# Altium schematic sheet Part11_I2S_WM8960.SchDoc
size A4
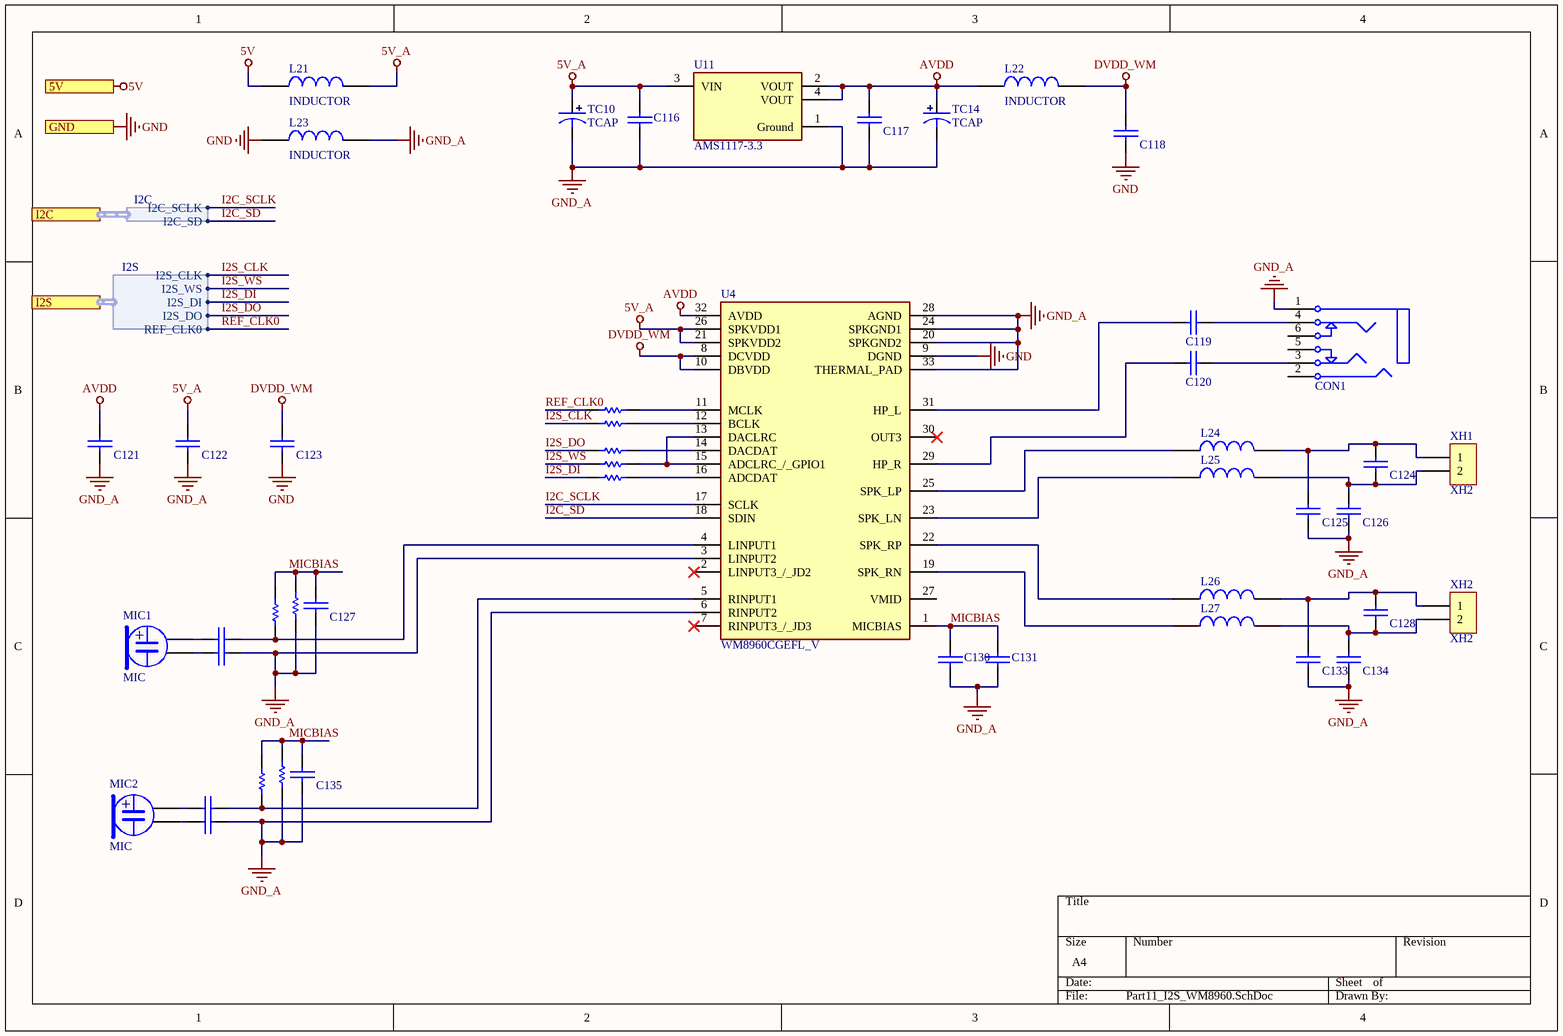
[diagram p0: Part11_I2S_WM8960.SchDoc]

## Parts
C116  100nF  [0603C]  (value not drawn)
C117  100nF  [0603C]  (value not drawn)
C118  100nF  [0402C]  (value not drawn)
C119  100nF  [1206C]  (value not drawn)
C120  100nF  [1206C]  (value not drawn)
C121  100nF  [0603C]  (value not drawn)
C122  100nF  [0603C]  (value not drawn)
C123  100nF  [0603C]  (value not drawn)
C124  100nF  [1206C]  (value not drawn)
C125  100nF  [1206C]  (value not drawn)
C126  100nF  [1206C]  (value not drawn)
C127  100nF  [0603C]  (value not drawn)
C128  100nF  [1206C]  (value not drawn)
C129  100nF  [0603C]  (value not drawn)
C130  100nF  [0402C]  (value not drawn)
C131  100nF  [0402C]  (value not drawn)
C132  100nF  [0603C]  (value not drawn)
C133  100nF  [1206C]  (value not drawn)
C134  100nF  [1206C]  (value not drawn)
C135  100nF  [0603C]  (value not drawn)
C136  100nF  [0603C]  (value not drawn)
C137  100nF  [0603C]  (value not drawn)
CON1  PJ342  [PJ342A]  (value not drawn)
L21  INDUCTOR  [0805L]
L22  INDUCTOR  [0805L]
L23  INDUCTOR  [0805L]
L24  INDUCTOR  [0805L]  (value not drawn)
L25  INDUCTOR  [0805L]  (value not drawn)
L26  INDUCTOR  [0805L]  (value not drawn)
L27  INDUCTOR  [0805L]  (value not drawn)
MIC1  MIC  [MIC-4.5X1.9]
MIC2  MIC  [MIC-4.5X1.9]
R21  0R  [0402R]  (value not drawn)
R22  0R  [0402R]  (value not drawn)
R23  0R  [0402R]  (value not drawn)
R24  0R  [0402R]  (value not drawn)
R101  0R  [0402R]  (value not drawn)
R102  0R  [0402R]  (value not drawn)
R103  0R  [0402R]  (value not drawn)
R104  0R  [0402R]  (value not drawn)
R105  0R  [0402R]  (value not drawn)
TC10  TCAP  [TAJ-A/3216]
TC14  TCAP  [TAJ-A/3216]
U4  WM8960CGEFL_V  [QFN50P500X500X100-33N]
U11  AMS1117-3.3  [FP-AMS1117-IPC_C]
XH1  XH2  [XH2/2.54mm/180]
XH2  XH2  [XH2/2.54mm/180]

## Ports
5V, GND, I2C (harness I2C), I2S (harness I2S)

## Harnesses
I2S: I2S_CLK, I2S_WS, I2S_DI, I2S_DO, REF_CLK0
I2C: I2C_SCLK, I2C_SD

## Nets
5V: L21.1 ; port 5V
5V_A: C116.1 C122.2 L21.2 TC10.1 U4.21(SPKVDD2) U4.26(SPKVDD1) U11.3(VIN)
AVDD: C117.1 C121.2 L22.1 TC14.1 U4.32(AVDD) U11.2(VOUT) U11.4(VOUT)
DVDD_WM: C118.1 C123.1 L22.2 U4.8(DCVDD) U4.10(DBVDD)
GND: C118.2 C123.2 L23.1 U4.9(DGND) ; port GND
GND_A: C116.2 C117.2 C121.1 C122.1 C125.1 C126.1 C127.2 C130.2 C131.2 C132.1 C133.1 C134.1 C135.2 C137.1 CON1.1 L23.2 R102.1 R104.1 TC10.2 TC14.2 U4.3(LINPUT2) U4.6(RINPUT2) U4.20(SPKGND2) U4.24(SPKGND1) U4.28(AGND) U4.33(THERMAL_PAD) U11.1(Ground)
I2C_SCLK: U4.17(SCLK) ; port I2C.I2C_SCLK
I2C_SD: U4.18(SDIN) ; port I2C.I2C_SD
I2S_CLK: R22.1 ; port I2S.I2S_CLK
I2S_DI: R101.1 ; port I2S.I2S_DI
I2S_DO: R23.1 ; port I2S.I2S_DO
I2S_WS: R24.1 ; port I2S.I2S_WS
MICBIAS: C127.1 C130.1 C131.1 C135.1 R102.2 R103.2 R104.2 R105.2 U4.1(MICBIAS)
REF_CLK0: R21.1 ; port I2S.REF_CLK0
NetC119_1: C119.1 CON1.4
NetC119_2: C119.2 U4.31(HP_L)
NetC120_1: C120.1 CON1.3
NetC120_2: C120.2 U4.29(HP_R)
NetC124_1: C124.1 C126.2 L25.2 XH1.2
NetC124_2: C124.2 C125.2 L24.2 XH1.1
NetC128_1: C128.1 C134.2 L27.2 XH2.2
NetC128_2: C128.2 C133.2 L26.2 XH2.1
NetC129_1: C129.1 R103.1 U4.4(LINPUT1)
NetC129_2: C129.2 MIC1.1
NetC132_2: C132.2 MIC1.2
NetC136_1: C136.1 R105.1 U4.5(RINPUT1)
NetC136_2: C136.2 MIC2.1
NetC137_2: C137.2 MIC2.2
NetL24_1: L24.1 U4.25(SPK_LP)
NetL25_1: L25.1 U4.23(SPK_LN)
NetL26_1: L26.1 U4.22(SPK_RP)
NetL27_1: L27.1 U4.19(SPK_RN)
NetR21_2: R21.2 U4.11(MCLK)
NetR22_2: R22.2 U4.12(BCLK)
NetR23_2: R23.2 U4.14(DACDAT)
NetR24_2: R24.2 U4.13(DACLRC) U4.15(ADCLRC_/_GPIO1)
NetR101_2: R101.2 U4.16(ADCDAT)

Not connected (* = marked no-connect by the designer): CON1 2 5 6; U4 2(LINPUT3_/_JD2)* 7(RINPUT3_/_JD3)* 27(VMID) 30(OUT3)*

## Notes on the sheet
- (in symbol MIC) +

## Library data of the parts
C116-C137 = CAP: 无极性电容
CON1 = PJ342: 3.5耳机插座,4Pin; BOM名称: 耳机插座; 版权归属: 源创客; 学习资源: www.ooocke.com
MIC1 MIC2 = MIC: 电容麦克风
R21-R24 R101-R105 = RES
TC10 TC14 = TCAP: 钽电容
U4 = WM8960CGEFL_V: Undefined or Miscellaneous; Manufacturer_Name: WOLFSON MICROELECTRONICS; Manufacturer_Part_Number: WM8960CGEFL/V; Datasheet Link: https://componentsearchengine.com/Datasheets/2/WM8960CGEFL_V.pdf; Height: 1mm; Arrow Part Number: WM8960CGEFL/V
U11 = CMP-209535-000001-1: LDO Voltage Regulators 1A, 3.3V; Manufacturer: Advanced Monolithic Systems; Dropout Voltage: 1.1V; Output Type: Fixed; Nominal Supply Current: 5mA; Max Power Dissipation: 1.2W; Max Supply Voltage: 15V; Number Of Outputs: 1; Standoff Height: 0.64mm; Max Junction Temp: +125°C; Height: 1.8mm; Package: AMS1117; Device Class L2: Power Management ICs; ComponentLink2Description: Datasheet; ComponentLink2URL: http://www.advanced-monolithic.com/pdf/ds1117.pdf; Category: IC; RoHS: TRUE; Automotive: No; Device Class L1: Integrated Circuits (ICs); Output Current: 1A; Device Class L3: Voltage Regulators - Linear; Temperature: -40°C to +125°C; Output Voltage: 3.3V; Manufacturer Part Number: AMS1117-3.3; Temperature Range Low: -40°C; Octopart: https://octopart.com/ams1117-3.3-advanced+monolithic+systems-25899300; Lead Free: Yes; Ipc Land Pattern Name: SOT229P700X180-4; Temperature Range High: +125°C